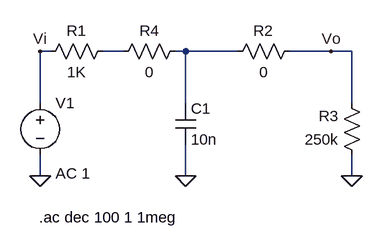
[diagram p0: schematic ToneFilter&OutputStage.asc]
ToneFilter&OutputStage.asc, the LTspice schematic file:
Version 4
SHEET 1 880 680
WIRE -160 64 -176 64
WIRE -48 64 -80 64
WIRE 48 64 32 64
WIRE 128 64 48 64
WIRE 272 64 208 64
WIRE 304 64 272 64
WIRE -176 144 -176 64
WIRE 48 144 48 64
WIRE 304 144 304 64
WIRE -176 256 -176 224
WIRE 48 256 48 208
WIRE 304 256 304 224
FLAG 48 256 0
FLAG 304 256 0
FLAG -176 256 0
FLAG 272 64 Vo
FLAG -176 64 Vi
SYMBOL res -64 48 R90
WINDOW 0 0 56 VBottom 2
WINDOW 3 32 56 VTop 2
SYMATTR InstName R1
SYMATTR Value 1K
SYMBOL cap 32 144 R0
SYMATTR InstName C1
SYMATTR Value 10n
SYMBOL res 224 48 R90
WINDOW 0 0 56 VBottom 2
WINDOW 3 32 56 VTop 2
SYMATTR InstName R2
SYMATTR Value 0
SYMBOL res 320 240 R180
WINDOW 0 36 76 Left 2
WINDOW 3 36 40 Left 2
SYMATTR InstName R3
SYMATTR Value 250k
SYMBOL voltage -176 128 R0
WINDOW 123 24 124 Left 2
WINDOW 39 0 0 Left 0
SYMATTR InstName V1
SYMATTR Value ""
SYMATTR Value2 AC 1
SYMBOL res 48 48 R90
WINDOW 0 0 56 VBottom 2
WINDOW 3 32 56 VTop 2
SYMATTR InstName R4
SYMATTR Value 0
TEXT -178 320 Left 2 !.ac dec 100 1 1meg

The netlist it stands for:
* ToneFilter&OutputStage.asc
R1 N001 Vi 1K
C1 N002 0 10n
R2 Vo N002 0
R3 0 Vo 250k
V1 Vi 0 AC 1
R4 N002 N001 0
.ac dec 100 1 1meg
.backanno
.end